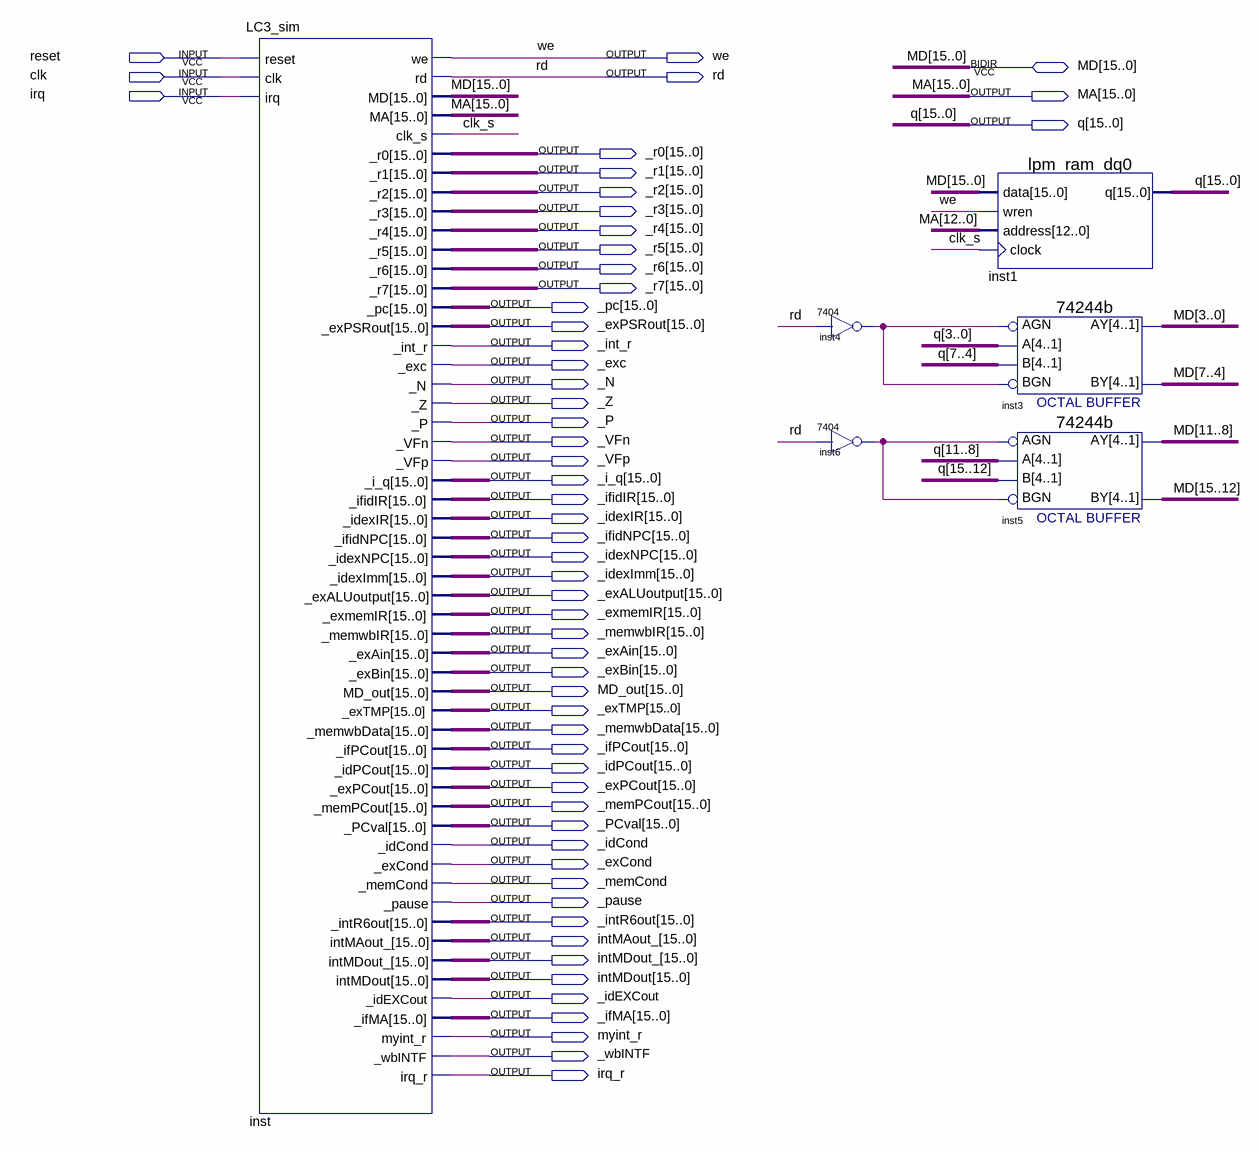
[diagram p0: schematic sheet]
// Quartus schematic LC3.bdf as structural Verilog: 6 symbols, 57 pins
module LC3 (
  input  reset,
  input  clk,
  input  irq,
  inout  [15:0] MD,
  output we,
  output rd,
  output [15:0] MA,
  output [15:0] q,
  output [15:0] _r0,
  output [15:0] _r1,
  output [15:0] _r2,
  output [15:0] _r3,
  output [15:0] _r4,
  output [15:0] _r5,
  output [15:0] _r6,
  output [15:0] _r7,
  output [15:0] _pc,
  output [15:0] _exPSRout,
  output _int_r,
  output _exc,
  output _N,
  output _Z,
  output _P,
  output _VFn,
  output _VFp,
  output [15:0] _i_q,
  output [15:0] _ifidIR,
  output [15:0] _idexIR,
  output [15:0] _ifidNPC,
  output [15:0] _idexNPC,
  output [15:0] _idexImm,
  output [15:0] _exALUoutput,
  output [15:0] _exmemIR,
  output [15:0] _memwbIR,
  output [15:0] _exAin,
  output [15:0] _exBin,
  output [15:0] MD_out,
  output [15:0] _exTMP,
  output [15:0] _memwbData,
  output [15:0] _ifPCout,
  output [15:0] _idPCout,
  output [15:0] _exPCout,
  output [15:0] _memPCout,
  output [15:0] _PCval,
  output _idCond,
  output _exCond,
  output _memCond,
  output _pause,
  output [15:0] _intR6out,
  output [15:0] intMAout_,
  output [15:0] intMDout_,
  output [15:0] intMDout,
  output _idEXCout,
  output [15:0] _ifMA,
  output myint_r,
  output _wbINTF,
  output irq_r
);

  wire clk_s, inst4_1, inst6_1;

  LC3_sim inst (
    .reset(reset), .clk(clk), .irq(irq), .we(we), .rd(rd), .MA(MA), .clk_s(clk_s), ._r0(_r0), ._r1(_r1),
    ._r2(_r2), ._r3(_r3), ._r4(_r4), ._r5(_r5), ._r6(_r6), ._r7(_r7), ._pc(_pc), ._exPSRout(_exPSRout),
    ._int_r(_int_r), ._exc(_exc), ._N(_N), ._Z(_Z), ._P(_P), ._VFn(_VFn), ._VFp(_VFp), ._i_q(_i_q),
    ._ifidIR(_ifidIR), ._idexIR(_idexIR), ._ifidNPC(_ifidNPC), ._idexNPC(_idexNPC), ._idexImm(_idexImm),
    ._exALUoutput(_exALUoutput), ._exmemIR(_exmemIR), ._memwbIR(_memwbIR), ._exAin(_exAin), ._exBin(_exBin),
    .MD_out(MD_out), ._exTMP(_exTMP), ._memwbData(_memwbData), ._ifPCout(_ifPCout), ._idPCout(_idPCout),
    ._exPCout(_exPCout), ._memPCout(_memPCout), ._PCval(_PCval), ._idCond(_idCond), ._exCond(_exCond),
    ._memCond(_memCond), ._pause(_pause), ._intR6out(_intR6out), .intMAout_(intMAout_),
    .intMDout_(intMDout_), .intMDout(intMDout), ._idEXCout(_idEXCout), ._ifMA(_ifMA), .myint_r(myint_r),
    ._wbINTF(_wbINTF), .irq_r(irq_r), .MD(MD));
  \7404  inst4 (.\2 (rd), .\1 (inst4_1));
  \7404  inst6 (.\2 (rd), .\1 (inst6_1));
  lpm_ram_dq0 inst1 (.data(MD), .wren(we), .address(MA[12:0]), .clock(clk_s), .q(q));
  \74244b  inst3 (.AGN(inst4_1), .B(q[7:4]), .BGN(inst4_1), .A(q[3:0]), .AY(MD[3:0]), .BY(MD[7:4]));
  \74244b  inst5 (.AGN(inst6_1), .B(q[15:12]), .BGN(inst6_1), .A(q[11:8]), .AY(MD[11:8]), .BY(MD[15:12]));
endmodule
